# EAGLE design adc_40MHz (EAGLE 7.4.0)
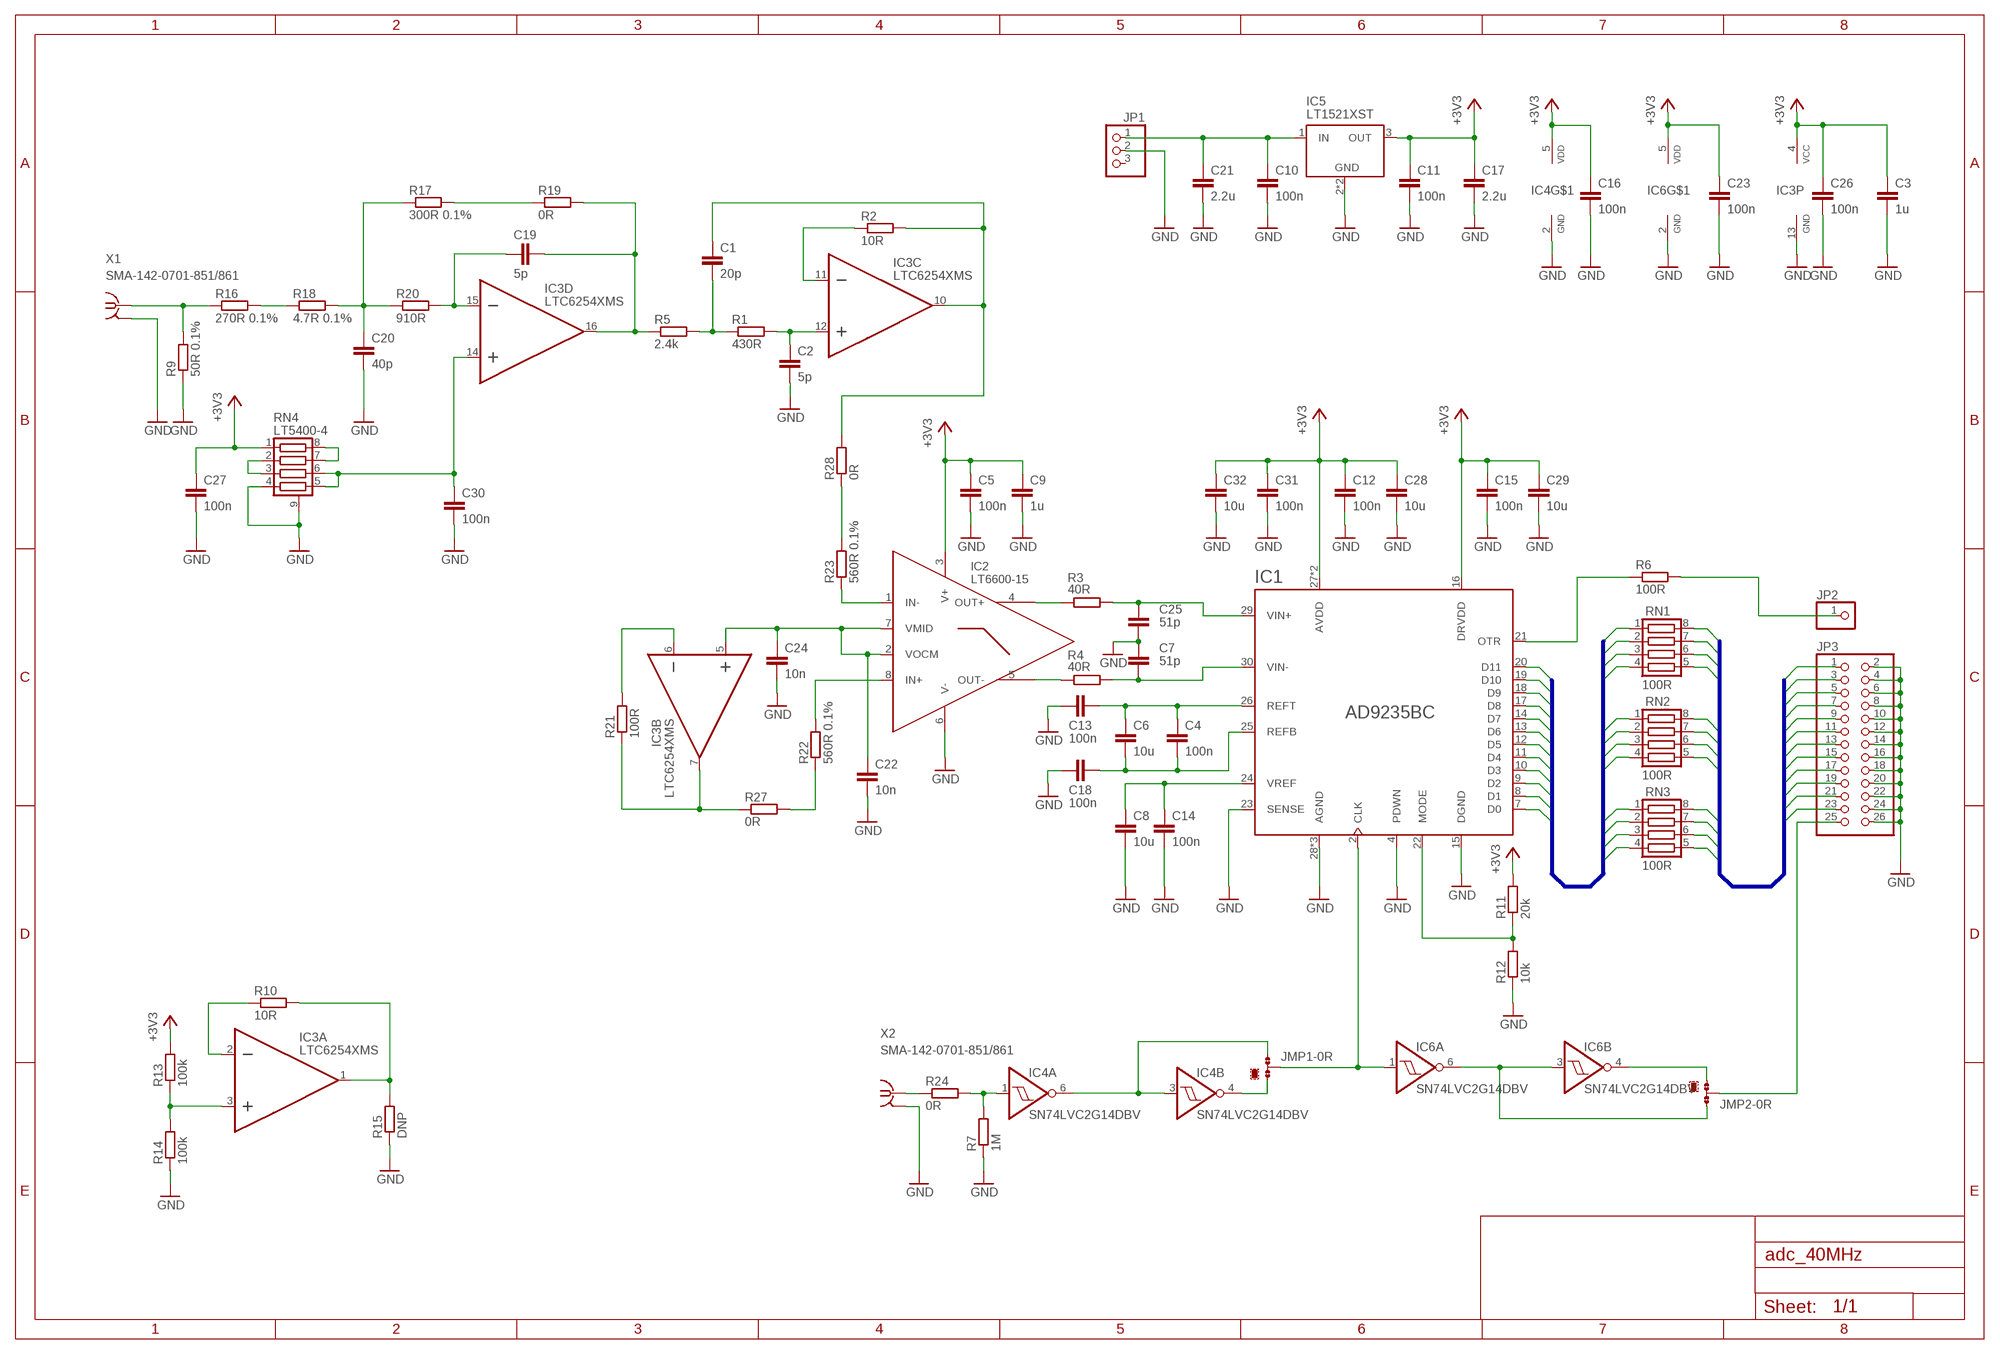
[diagram p0: schematic, sheet 1]

## Parts
C1  20p  C-EUC0603K  [C0603K]
C2  5p  C-EUC0603K  [C0603K]
C3  1u  C-EUC0805  [C0805]
C4  100n  C-EUC0603K  [C0603K]
C5  100n  C-EUC0603K  [C0603K]
C6  10u  C-EUC1206  [C1206]
C7  51p  C-EUC0603K  [C0603K]
C8  10u  C-EUC1206  [C1206]
C9  1u  C-EUC0805  [C0805]
C10  100n  C-EUC0603K  [C0603K]
C11  100n  C-EUC0603K  [C0603K]
C12  100n  C-EUC0603K  [C0603K]
C13  100n  C-EUC0603K  [C0603K]
C14  100n  C-EUC0603K  [C0603K]
C15  100n  C-EUC0603K  [C0603K]
C16  100n  C-EUC0603K  [C0603K]
C17  2.2u  C-EUC0805  [C0805]
C18  100n  C-EUC0603K  [C0603K]
C19  5p  C-EUC0603K  [C0603K]
C20  40p  C-EUC0603K  [C0603K]
C21  2.2u  C-EUC0805  [C0805]
C22  10n  C-EUC0603K  [C0603K]
C23  100n  C-EUC0603K  [C0603K]
C24  10n  C-EUC0603K  [C0603K]
C25  51p  C-EUC0603K  [C0603K]
C26  100n  C-EUC0603K  [C0603K]
C27  100n  C-EUC0603K  [C0603K]
C28  10u  C-EUC1206  [C1206]
C29  10u  C-EUC1206  [C1206]
C30  100n  C-EUC0603K  [C0603K]
C31  100n  C-EUC0603K  [C0603K]
C32  10u  C-EUC1206  [C1206]
IC1  AD9235BC  [LFCSP32]
IC2  LT6600-15  [S8]
IC3  LTC6254XMS  [MSOP16]
IC4  SN74LVC2G14DBV  [SOT23-6]
IC5  LT1521XST  [SOT223]
IC6  SN74LVC2G14DBV  [SOT23-6]
JMP1  0R-JUMPA  [A0R-JMP]
JMP2  0R-JUMPA  [A0R-JMP]
JP1  PINHD-1X3  [1X03]
JP2  PINHD-1X1  [1X01]
JP3  PINHD-2X13  [2X13]
R1  430R  R-EU_R0603  [R0603]
R2  10R  R-EU_R0603  [R0603]
R3  40R  R-EU_R0603  [R0603]
R4  40R  R-EU_R0603  [R0603]
R5  2.4k  R-EU_R0603  [R0603]
R6  100R  R-EU_R0603  [R0603]
R7  1M  R-EU_R0603  [R0603]
R9  50R 0.1%  R-EU_R0603  [R0603]
R10  10R  R-EU_R0603  [R0603]
R11  20k  R-EU_R0603  [R0603]
R12  10k  R-EU_R0603  [R0603]
R13  100k  R-EU_R0603  [R0603]
R14  100k  R-EU_R0603  [R0603]
R15  DNP  R-EU_R0603  [R0603]
R16  270R 0.1%  R-EU_R0603  [R0603]
R17  300R 0.1%  R-EU_R0603  [R0603]
R18  4.7R 0.1%  R-EU_R0603  [R0603]
R19  0R  R-EU_R0603  [R0603]
R20  910R  R-EU_R0603  [R0603]
R21  100R  R-EU_R0603  [R0603]
R22  560R 0.1%  R-EU_R0603  [R0603]
R23  560R 0.1%  R-EU_R0603  [R0603]
R24  0R  R-EU_R0603  [R0603]
R27  0R  R-EU_R0603  [R0603]
R28  0R  R-EU_R0603  [R0603]
RN1  100R  CTS742C083  [EXB38V]
RN2  100R  CTS742C083  [EXB38V]
RN3  100R  CTS742C083  [EXB38V]
RN4  LT5400-4  LT5400  [MS8E]
X1  SMA-142-0701-851/861  [J502-ND-142-0701-851/861]
X2  SMA-142-0701-851/861  [J502-ND-142-0701-851/861]

## Nets
+3V3: C3.1 C5.1 C9.1 C11.1 C12.1 C15.1 C16.1 C17.1 C23.1 C26.1 C27.1 C28.1 C29.1 C31.1 C32.1 IC1.16(DRVDD) IC1.27(AVDD) IC1.32(AVDD) IC2.3(V+) IC3.4(P:V+) IC4.5(V+) IC5.3(OUT) IC6.5(V+) R11.2 R13.2 RN4.1
ADC_D0: IC1.7(D0) RN3.4
ADC_D1: IC1.8(D1) RN3.3
ADC_D2: IC1.9(D2) RN3.2
ADC_D3: IC1.10(D3) RN3.1
ADC_D4: IC1.11(D4) RN2.4
ADC_D5: IC1.12(D5) RN2.3
ADC_D6: IC1.13(D6) RN2.2
ADC_D7: IC1.14(D7) RN2.1
ADC_D8: IC1.17(D8) RN1.4
ADC_D9: IC1.18(D9) RN1.3
ADC_D10: IC1.19(D10) RN1.2
ADC_D11: IC1.20(D11) RN1.1
CLK: JMP2.2 JP3.25
DAC_D0: JP3.23 RN3.5
DAC_D1: JP3.21 RN3.6
DAC_D2: JP3.19 RN3.7
DAC_D3: JP3.17 RN3.8
DAC_D4: JP3.15 RN2.5
DAC_D5: JP3.13 RN2.6
DAC_D6: JP3.11 RN2.7
DAC_D7: JP3.9 RN2.8
DAC_D8: JP3.7 RN1.5
DAC_D9: JP3.5 RN1.6
DAC_D10: JP3.3 RN1.7
DAC_D11: JP3.1 RN1.8
GND: C2.2 C3.2 C5.2 C7.1 C8.2 C9.2 C10.2 C11.2 C12.2 C13.1 C14.2 C15.2 C16.2 C17.2 C18.1 C20.2 C21.2 C22.2 C23.2 C24.2 C25.2 C26.2 C27.2 C28.2 C29.2 C30.2 C31.2 C32.2 IC1.4(PDWN) IC1.15(DGND) IC1.23(SENSE) IC1.28(AGND) IC1.31(AGND) IC1.EXP(AGND) IC2.6(V-) IC3.13(P:V-) IC4.2(V-) IC5.2(GND) IC5.4(GND) IC6.2(V-) JP1.2 JP3.2 JP3.4 JP3.6 JP3.8 JP3.10 JP3.12 JP3.14 JP3.16 JP3.18 JP3.20 JP3.22 JP3.24 JP3.26 R7.1 R9.1 R12.1 R14.1 R15.1 RN4.4 RN4.9(EP) X1.G@1 X1.G@2 X1.G@3 X1.G@4 X2.G@1 X2.G@2 X2.G@3 X2.G@4
N$1: IC2.4(OUT+) R3.1
N$2: C25.1 IC1.29(VIN+) R3.2
N$3: C7.2 IC1.30(VIN-) R4.2
N$4: IC2.5(OUT-) R4.1
N$5: C8.1 C14.1 IC1.24(VREF)
N$6: IC1.21(OTR) R6.1
N$7: C4.2 C6.2 C18.2 IC1.25(REFB)
N$8: JP2.1 R6.2
N$10: C22.1 C24.1 IC2.2(VOCM) IC2.7(VMID) IC3.5(B:+IN)
N$12: IC3.3(A:+IN) R13.1 R14.2
N$13: IC3.7(B:OUT) R21.1 R27.1
N$14: IC3.2(A:-IN) R10.1
N$15: IC3.1(A:OUT) R10.2 R15.2
N$16: RN4.7 RN4.8
N$17: IC3.6(B:-IN) R21.2
N$18: R24.1 X2.1
N$19: R16.2 R18.1
N$20: C20.1 R17.1 R18.2 R20.1
N$21: R17.2 R19.1
N$22: C19.2 IC3.16(D:OUT) R5.1 R19.2
N$23: C19.1 IC3.15(D:-IN) R20.2
N$24: C30.1 IC3.14(D:+IN) RN4.5 RN4.6
N$25: RN4.2 RN4.3
N$26: IC3.11(C:-IN) R2.1
N$27: C1.1 IC3.10(C:OUT) R2.2 R28.2
N$28: C1.2 R1.1 R5.2
N$29: C2.1 IC3.12(C:+IN) R1.2
N$30: IC2.8(IN+) R22.2
N$31: IC2.1(IN-) R23.1
N$32: IC1.22(MODE) R11.1 R12.2
N$33: C4.1 C6.1 C13.2 IC1.26(REFT)
N$34: IC4.1(A:I) R7.2 R24.2
N$36: IC4.3(B:I) IC4.6(A:O) JMP1.1
N$37: IC1.2(CLK) IC6.1(A:I) JMP1.2
N$38: IC6.3(B:I) IC6.6(A:O) JMP2.1
N$39: IC4.4(B:O) JMP1.3
N$40: R23.2 R28.1
N$41: IC6.4(B:O) JMP2.3
N$42: R22.1 R27.2
SIGIN: R9.2 R16.1 X1.1
VIN: C10.1 C21.1 IC5.1(IN) JP1.1
Unconnected: JP1.3

## Buses
ADC_D[0..11]
DAC_D[0..11]

## Library data of the parts
C1 C2 C4 C5 C7 C10-C16 C18-C20 C22-C27 C30 C31 = resistor:C-EU: CAPACITOR, European symbol
C3 C6 C8 C9 C17 C21 C28 C29 C32 = rcl:C-EU: CAPACITOR, European symbol
IC1 = ad9235:AD9235: 12 Bit A/D - Wandler (Analog)
IC2 = lt6600:LT6600-15: Very Low Noise, Differential Amplifier and 15MHz Lowpass Filter
IC3 = ltc625x:LTC6254X
IC4 IC6 = sn74lvc2g14:SN74LVC2G14
IC5 = lt1521:LT1521XST
JMP1 JMP2 = jump-0r-smd:0R-JUMP: SMD 0R 0805 Jumper
JP1 = moj_pinhead:PINHD-1X3: PIN HEADER
JP2 = pinhead:PINHD-1X1: PIN HEADER
JP3 = moj_pinhead:PINHD-2X13: PIN HEADER
R1-R7 R9-R24 R27 R28 = rcl:R-EU_: RESISTOR, European symbol
RN1-RN3 = passive:CTS742C083: Chip Resistor Array 4 Single Resistor Source: http://www.ctscorp.com/components/Datasheets/CTSChipArrayDs.pdf
RN4 = lt5400:LT5400
X1 X2 = con-coax:SMA-: SMA 50 Ohm End Launch Jack Receptacle - Round Contact Johnson Components Source: www.johnsoncomponents.com .. J502-ND.pdf; MF: JOHNSON COMPONENTS; MPN: 142-0701-851; OC_FARNELL: 1019325; OC_NEWARK: 99F6798

## Board
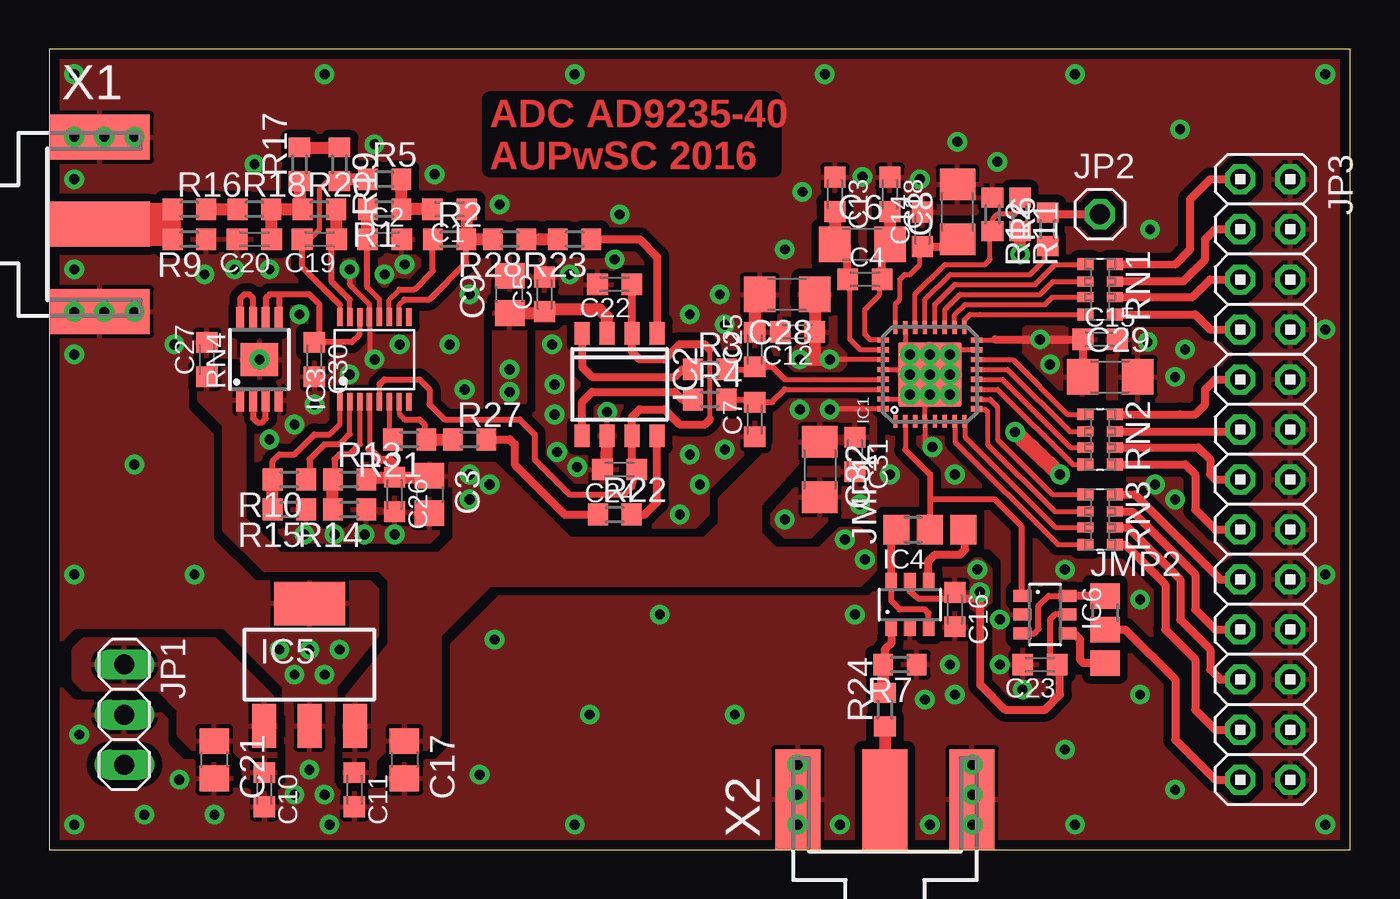
[diagram p1: board, top side]
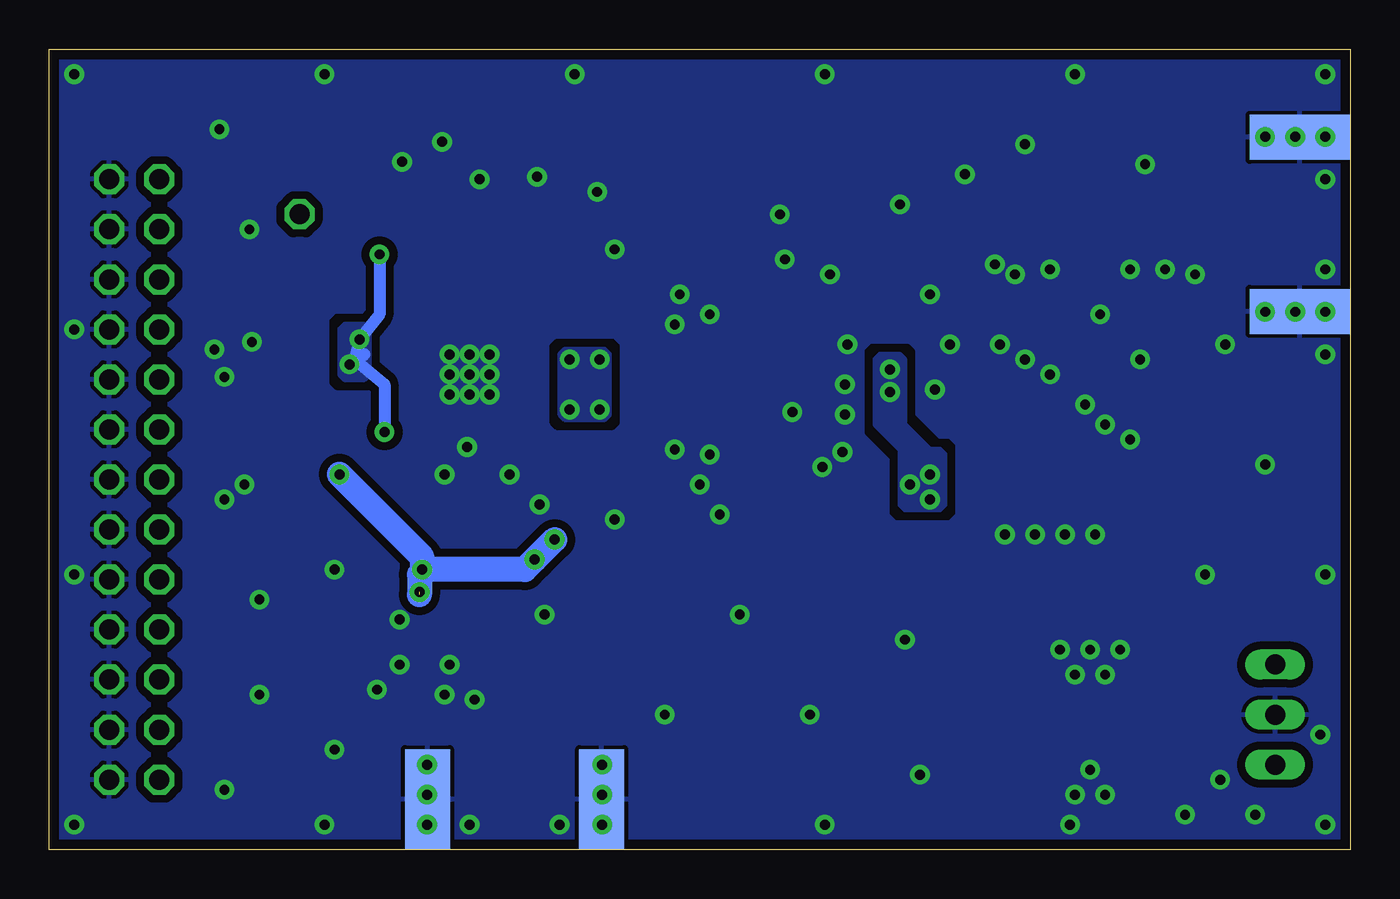
[diagram p2: board, bottom side, seen from below]

Size 66.04 x 40.64 mm. Coordinates in mm from the lower left corner, seen from the top.
Outline: 0,0 66.04,0 66.04,40.64 0,40.64 0,0
Copper layers (1*2+16): Top 0.035mm / dielectric 1.5mm / Route2 0.035mm / dielectric 0.15mm / Bottom 0.035mm
Design rules "satland_standard": minimum track width 8mil, minimum drill 0.3mm, track to track 8mil, track to pad 8mil, pad to pad 8mil, via to via 8mil, smd to smd 0mil, copper to edge 20mil, drill to drill 10mil, minimum pad ring 8mil, minimum via ring 8mil, stop-mask expansion 4mil, vias tented up to drill 0mil, thermal gap 8mil

### Footprints (pad centres in the part's own frame; a part is rotated, then mirrored left to right if it is on the bottom)
C0603K = smd 1.05 x 1.08: 1 -0.875,0; 2 0.875,0
C0805 = smd 1.3 x 1.5: 1 -0.95,0; 2 0.95,0
C1206 = smd 1.6 x 1.8: 1 -1.4,0; 2 1.4,0
LFCSP32 = smd 0.65 x 0.27: 1 -2.375,1.75; 2 -2.375,1.25; 3 -2.375,0.75; 4 -2.375,0.25; 5 -2.375,-0.25; 6 -2.375,-0.75; 7 -2.375,-1.25; 8 -2.375,-1.75; 17 2.375,-1.75; 18 2.375,-1.25; 19 2.375,-0.75; 20 2.375,-0.25; 21 2.375,0.25; 22 2.375,0.75; 23 2.375,1.25; 24 2.375,1.75 | smd 0.27 x 0.65: 9 -1.75,-2.375; 10 -1.25,-2.375; 11 -0.75,-2.375; 12 -0.25,-2.375; 13 0.25,-2.375; 14 0.75,-2.375; 15 1.25,-2.375; 16 1.75,-2.375; 25 1.75,2.375; 26 1.25,2.375; 27 0.75,2.375; 28 0.25,2.375; 29 -0.25,2.375; 30 -0.75,2.375; 31 -1.25,2.375; 32 -1.75,2.375 | smd 3.25 x 3.25: EXP 0,0
S8 = smd 0.762 x 1.143: 1 -1.905,-2.6; 2 -0.635,-2.6; 3 0.635,-2.6; 4 1.905,-2.6; 5 1.905,2.6; 6 0.635,2.6; 7 -0.635,2.6; 8 -1.905,2.6
MSOP16 = smd 0.275 x 0.9: 1 -1.75,-2.15; 2 -1.25,-2.15; 3 -0.75,-2.15; 4 -0.25,-2.15; 5 0.25,-2.15; 6 0.75,-2.15; 7 1.25,-2.15; 8 1.75,-2.15; 9 1.75,2.15; 10 1.25,2.15; 11 0.75,2.15; 12 0.25,2.15; 13 -0.25,2.15; 14 -0.75,2.15; 15 -1.25,2.15; 16 -1.75,2.15
SOT23-6 = smd 0.6 x 0.9: 1 -0.95,-1.15; 2 0,-1.15; 3 0.95,-1.15; 4 0.95,1.15; 5 0,1.15; 6 -0.95,1.15
SOT223 = smd 1.219 x 2.235: 1 -2.311,-3.099; 2 0,-3.099; 3 2.311,-3.099 | smd 3.6 x 2.2: 4 0,3.099
A0R-JMP = smd 1.5 x 1.3: 1 0,1.7; 2 0,0; 3 0,-1.7
1X03 = drill 1.016 long: 1 -2.54,0; 2 0,0; 3 2.54,0
1X01 = drill 1.016 octagon: 1 0,0
2X13 = drill 1.016 octagon: 1 -15.24,-1.27; 2 -15.24,1.27; 3 -12.7,-1.27; 4 -12.7,1.27; 5 -10.16,-1.27; 6 -10.16,1.27; 7 -7.62,-1.27; 8 -7.62,1.27; 9 -5.08,-1.27; 10 -5.08,1.27; 11 -2.54,-1.27; 12 -2.54,1.27; 13 0,-1.27; 14 0,1.27; 15 2.54,-1.27; 16 2.54,1.27; 17 5.08,-1.27; 18 5.08,1.27; 19 7.62,-1.27; 20 7.62,1.27; 21 10.16,-1.27; 22 10.16,1.27; 23 12.7,-1.27; 24 12.7,1.27; 25 15.24,-1.27; 26 15.24,1.27
R0603 = smd 1 x 1.1: 1 -0.85,0; 2 0.85,0
EXB38V = smd 0.6 x 0.8: 1 -1.275,-0.75; 4 1.275,-0.75; 5 1.275,0.75; 8 -1.275,0.75 | smd 0.5 x 0.8: 2 -0.4,-0.75; 3 0.4,-0.75; 6 0.4,0.75; 7 -0.4,0.75
MS8E = smd 0.4 x 1.2: 1 -0.975,-2.05; 2 -0.325,-2.05; 3 0.325,-2.05; 4 0.975,-2.05; 5 0.975,2.05; 6 0.325,2.05; 7 -0.325,2.05; 8 -0.975,2.05 | smd 1.88 x 1.68: 9 0,0
J502-ND-142-0701-851/861 = smd 5.08 x 2.286: 1 2.565,0; G@1 2.565,4.42; G@2 2.565,-4.42 | smd 5.08 x 2.286 bottom: G@3 2.565,4.42; G@4 2.565,-4.42

### Placement (x,y rotation side)
C1  20.32,32.51 180 top
C2  17.02,30.99 0 top
C3  19.3,18.03 270 top
C4  41.4,28.96 0 top
C5  25.15,28.19 90 top
C6  41.27,30.73 0 top
C7  35.81,21.84 90 top
C8  46.1,32.38 90 top
C9  23.37,28.19 90 top
C10  10.92,3.05 270 top
C11  15.49,3.05 270 top
C12  37.97,26.29 180 top
C13  39.88,33.27 270 top
C14  44.32,31.5 90 top
C15  53.34,25.91 0 top
C16  45.97,12.19 270 top
C17  18.03,4.57 270 top
C18  42.67,33.27 270 top
C19  13.72,30.99 180 top
C20  10.41,30.99 180 top
C21  8.38,4.57 270 top
C22  28.7,28.7 180 top
C23  50.29,9.4 180 top
C24  28.96,19.3 180 top
C25  35.81,25.4 90 top
C26  17.53,18.03 270 top
C27  8,24.89 90 top
C28  37.47,28.19 180 top
C29  53.85,24 0 top
C30  13.46,24.89 270 top
C31  40.89,20.07 270 top
C32  39.12,19.3 270 top
IC1  44.7,24.13 90 top
IC2  28.96,23.62 180 top
IC3  16.51,24.89 0 top
IC4  43.69,12.45 0 top
IC5  13.21,9.4 0 top
IC6  50.55,11.94 270 top
JMP1  44.7,16.26 90 top
JMP2  53.59,11.18 0 top
JP1  3.81,6.86 270 top
JP2  53.34,32.26 0 top
JP3  61.72,18.8 270 top
R1  17.02,32.51 180 top
R2  20.32,30.99 0 top
R3  33.53,24.38 0 top
R4  33.53,22.86 0 top
R5  17.02,34.04 0 top
R6  50.67,31.5 90 top
R7  43.18,9.4 180 top
R9  7.11,30.99 180 top
R10  12.19,18.8 180 top
R11  49.28,32.26 270 top
R12  47.88,32.26 270 top
R13  15.24,18.8 0 top
R14  15.24,17.27 180 top
R15  12.19,17.27 180 top
R16  7.11,32.51 0 top
R17  12.7,34.8 90 top
R18  10.41,32.51 0 top
R19  14.73,34.8 270 top
R20  13.72,32.51 0 top
R21  18.29,20.83 180 top
R22  28.7,17.02 0 top
R23  26.67,30.99 180 top
R24  42.42,7.11 90 top
R27  21.34,20.83 0 top
R28  23.37,30.99 180 top
RN1  53.34,28.45 270 top
RN2  53.34,20.83 270 top
RN3  53.34,16.76 270 top
RN4  10.67,24.89 0 top
X1  0,31.75 0 top
X2  42.42,0 90 top

### Tracks (layer width: path | path; a pad name or v marks a point on that pad's centre or on a via)
+3V3  (via drill 0.5 pad 1)  (1 unrouted)
  Top 0.254: IC3.4 16.26,20.32 | IC1.32 39.65,22.38 v39.62,22.35 | 39.64,24.88 v39.62,24.89 42.32,24.89 IC1.27 | IC1.16 47.98,25.88 48.01,25.91
  Top 0.305: IC4.5 43.69,13.11 44.08,12.76 46.18,12.76 C16.1 | C31.1 40.89,20.7 | IC6.5 51.05,11.94 50.8,11.68 50.8,9.77 C23.1
  Top 0.406: 16.26,20.32 16.76,19.81 17.27,19.81 17.53,19.56 C26.1 | R13.2 15.95,18.91 | 46.18,12.76 47.18,12.76 | v47.24,13.08 47.24,8.38 48.51,7.11 50.55,7.11 51.31,7.87 51.31,9.26 | C29.1 52.47,24.02 C15.1 v50.29,25.91 48.01,25.91
  Top 0.61: 15.95,18.91 C26.1 19.48,18.91 C3.1 | IC2.3 28.32,27.05 27.94,27.43 25.26,27.43 C5.1 25.32,27.24 C9.1 | 51.31,9.26 C23.1 | C28.1 38.87,26.31 C12.1 38.85,24.91 38.86,24.89 | v38.1,24.89 38.86,24.89 | 38.86,24.89 v39.62,24.89 | 40.66,20.7 C31.1 | R11.2 v49.28,30.23
  Top 0.813: 15.49,6.27 IC5.3 | v49.02,21.21 v51.31,19.05
  Bottom 0.61: v49.28,30.23 49.28,27.18 v50.29,25.91 50.55,24.89 | 50.55,24.89 49.02,23.62 v49.02,21.21 | v50.8,24.64 50.04,25.15 50.55,24.89
  Bottom 1.27: v40.39,15.75 v41.4,14.73 41.91,14.22 46.99,14.22 47.24,13.97 47.24,12.95 | v51.31,19.05 47.12,14.86 v47.12,14.22
  other vias: 23.37,23.24 23.37,24.38 21.34,19.05 22.35,18.54 21.34,17.78 38.1,22.35
  pour Top (isolate 0.61): 24.13,22.73 22.61,22.73 22.61,27.43 24.13,27.43
  pour Top (isolate 0.305): 19.81,10.92 22.35,13.46 41.15,13.46 41.91,14.22 41.91,15.49 41.15,16.26 40.13,16.26 39.12,15.24 36.83,15.24 36.07,16 36.07,17.53 38.35,20.07 40.13,20.07 40.13,20.32 41.91,20.32 41.91,21.84 40.89,22.86 37.59,22.86 36.83,22.1 36.83,20.57 34.04,17.78 34.04,16.51 33.27,15.75 26.42,15.75 22.61,19.56 15.75,19.56 15.75,18.54 20.57,18.54 20.57,15.75 19.81,14.99 11.68,14.99 9.91,16.76 9.91,23.37 9.14,23.37 9.14,24.38 7.62,24.38 7.62,22.86 8.89,21.59 8.89,16.26 10.92,14.22 16.76,14.22 17.27,13.72 17.27,10.41 14.99,7.62 14.99,3.56 16.26,3.56 16.51,3.81 16.51,4.57 17.02,5.08 19.05,5.08 19.81,5.84
  pour Bottom (isolate 0.406): 22.86,25.15 23.88,25.15 24.13,24.89 24.13,21.59 22.86,20.32 22.86,17.53 22.61,17.27 20.83,17.27 20.57,17.53 20.57,20.07 20.83,20.32 21.34,20.32 22.61,21.59 22.61,24.89
  pour Bottom (isolate 0.406): 37.59,25.15 37.85,25.4 39.88,25.4 40.13,25.15 40.13,22.1 39.88,21.84 37.85,21.84 37.59,22.1
  pour Top (isolate 0.406): 45.47,14.48 46.48,14.48 46.74,14.73 47.24,14.73 47.75,14.22 47.75,12.45 47.24,11.94 46.74,12.45 46.48,12.45 46.48,12.7 46.23,12.95 45.47,12.95
  pour Top: 37.85,24.38 40.13,24.38 40.39,24.64 40.39,25.15 39.88,25.65 39.88,27.18 39.62,27.43 39.62,28.96 38.1,28.96 38.1,25.65 37.59,25.15 37.59,24.64
  pour Bottom (isolate 0.406): 50.04,26.67 51.05,26.67 51.31,26.42 51.31,24.13 51.05,23.88 50.04,23.88 49.78,24.13 49.78,26.42
  pour Top (isolate 0.406): 49.78,26.67 51.31,26.67 51.56,26.42 51.82,26.42 53.09,26.42 53.09,23.11 51.82,23.11 51.56,23.11 50.8,23.88 50.55,23.88 49.78,24.64 49.53,24.89 49.53,26.42
ADC_D0
  Top 0.254: IC1.7 45.97,21.73 45.97,20.7 51.19,15.49 RN3.4
ADC_D1
  Top 0.254: IC1.8 46.48,21.73 46.48,20.95 51.07,16.36 RN3.3
ADC_D2
  Top 0.254: IC1.9 47.11,22.35 47.5,22.35 47.62,22.23 47.62,20.57 51.03,17.16 RN3.2
ADC_D3
  Top 0.254: IC1.10 47.1,22.86 47.75,22.86 48.13,22.48 48.13,20.83 50.92,18.04 RN3.1
ADC_D4
  Top 0.254: IC1.11 47.09,23.37 48.13,23.37 51.95,19.55 RN2.4
ADC_D5
  Top 0.254: IC1.12 48.39,23.88 51.84,20.43 RN2.3
ADC_D6
  Top 0.254: IC1.13 48.64,24.38 51.8,21.23 RN2.2
ADC_D7
  Top 0.254: IC1.14 48.91,24.88 51.68,22.1 RN2.1
ADC_D8
  Top 0.254: IC1.17 46.45,26.9 46.74,27.18 47.24,27.18 47.25,27.17 RN1.4
ADC_D9
  Top 0.254: IC1.18 45.95,27.16 46.48,27.69 50.55,27.69 50.91,28.05 RN1.3
ADC_D10
  Top 0.254: IC1.19 45.45,27.42 46.23,28.19 50.29,28.19 50.95,28.85 RN1.2
ADC_D11
  Top 0.254: IC1.20 44.95,27.68 45.97,28.7 50.04,28.7 51.05,29.72 RN1.1
CLK
  Top 0.406: JMP2.2 54.61,11.18 57.15,8.64 57.15,5.59 59.18,3.56 JP3.25
DAC_D0
  Top 0.406: RN3.5 54.62,15.49 56.64,13.46 56.64,11.18 58.17,9.65 58.17,7.11 59.18,6.1 JP3.23
DAC_D1
  Top 0.406: RN3.6 54.76,16.36 57.4,13.72 57.4,11.68 58.93,10.16 58.93,9.14 59.44,8.64 JP3.21
DAC_D2
  Top 0.406: RN3.7 54.97,17.16 58.17,13.97 58.17,12.19 59.18,11.18 JP3.19
DAC_D3
  Top 0.406: RN3.8 55.11,18.04 59.44,13.72 JP3.17
DAC_D4
  Top 0.406: RN2.5 57.66,19.56 58.17,19.05 58.17,17.27 59.18,16.26 JP3.15
DAC_D5
  Top 0.406: RN2.6 58.31,20.43 58.93,19.81 58.93,19.05 59.18,18.8 JP3.13
DAC_D6
  Top 0.406: RN2.7 60.34,21.23 JP3.11
DAC_D7
  Top 0.406: RN2.8 57.41,22.1 58.17,22.1 58.67,22.61 58.67,23.37 59.18,23.88 JP3.9
DAC_D8
  Top 0.406: RN1.5 58.17,27.17 58.93,26.42 JP3.7
DAC_D9
  Top 0.406: RN1.6 58.02,28.05 58.93,28.96 JP3.5
DAC_D10
  Top 0.406: JP3.3 59.18,31.5 58.67,30.99 58.67,29.97 57.55,28.85 RN1.7
DAC_D11
  Top 0.406: RN1.8 54.87,29.72 57.15,29.72 57.91,30.48 57.91,33.02 58.93,34.04 JP3.1
GND  (via drill 0.5 pad 1)
  Top 0.254: IC1.28 43.44,24.38 v43.69,24.13 | IC1.31 43.45,22.88 v43.69,23.11 | IC1.23 43.45,25.15 v43.69,25.15 | IC1.15 45.72,25.38 v45.72,25.15 | IC1.4 44.45,23.11 v44.7,23.11 | IC3.13 16.26,27.68 15.24,28.7 v15.24,29.46 | 16.26,26.92 16.26,25.15 v16.51,24.89 | 44.45,21.84 44.45,20.57
  Top 0.305: 2.56,28.17 X1.G@4
  Top 0.61: C24.2 28.32,19.8 IC2.6 | 35.81,26.42 35.81,27.69 36.07,27.94
  other vias: 17.02,29.21 10.67,24.89 17.78,25.65 15.24,24.13 44.7,24.13 45.72,24.13 44.7,25.15 45.72,23.11 18.03,29.72 13.46,22.61 11.18,20.83 12.95,16 14.48,16 16,16 17.53,16 26.42,29.21 21.34,28.19 21.08,23.37 20.32,25.65 25.65,22.1 25.53,25.65 25.78,20.19 26.8,19.43 12.45,21.59 11.68,10.16 14.73,10.16 13.21,10.16 12.45,8.89 13.97,8.89 13.21,4.06 12.45,2.79 13.97,2.79 55.75,25.78 57.66,25.4 57.15,24 48.26,11.68 48.26,9.4 49.4,8.13 45.72,9.4 44.45,7.62 45.97,7.87 41.15,17.53 42.67,19.05 45.97,19.05 1.27,39.37 13.97,39.37 26.67,39.37 39.37,39.37 52.07,39.37 64.77,39.37 1.27,1.27 14.22,1.27 26.67,1.27 40.13,1.27 44.7,1.27 52.07,1.27 64.77,1.27 1.52,5.84 1.27,25.15 64.77,26.42 64.77,13.97 1.27,29.46 1.27,34.04 10.41,34.8 19.56,34.29 16.51,35.81 22.86,32.77 28.96,32.26 32.51,27.18 34.29,26.67 34.04,28.19 37.34,30.48 41.27,34.16 38.23,33.4 44.2,34.04 46.1,35.94 48.13,34.92 55.88,31.5 55.37,7.87 57.15,3.05 55.37,12.7 51.56,14.22 56.13,18.54 57.15,17.78 1.27,13.97 6.6,3.56 8.38,1.78 4.83,1.78 4.32,19.56 7.37,13.97 7.87,29.21 11.18,29.46 9.4,29.46 6.35,25.65 57.4,36.58 51.56,5.08 32.51,20.07 34.29,20.32 32,17.02 28.32,22.23 25.65,23.62 12.7,27.18 37.34,16.76 33.02,18.54 28.7,29.97 22.61,10.67 30.99,11.94 40.89,11.94 34.8,6.86 27.43,6.86 44.83,20.45 37.97,4.32 37.97,2.79 37.97,1.27 46.86,4.32 46.86,1.27 46.86,2.79 1.27,36.2 4.32,36.2 2.79,36.2 1.27,27.3 4.32,27.3 2.79,27.3 21.84,3.81
  pour Bottom (isolate 0.406, rank 3): 0.25,40.39 0.25,0.25 65.79,0.25 65.79,40.39
  pour Top (isolate 0.406, rank 3): 0.25,40.39 0.25,0.25 65.79,0.25 65.79,40.39
N$1
  Top 0.406: IC2.4 27.05,24.51 27.56,24 31.75,24 32.13,24.38 R3.1
N$2
  Top 0.254: 37.34,23.88 IC1.29
  Top 0.305: R3.2 36.18,24.38 | C25.1 36.69,24.52 37.34,23.88
  Top 0.406: 36.18,24.38 C25.1
N$3
  Top 0.254: 37.34,23.37 42.32,23.37 IC1.30
  Top 0.305: R4.2 35.67,22.86 C7.2 36.69,22.72 37.34,23.37
N$4
  Top 0.406: IC2.5 27.05,22.73 27.56,23.24 31.75,23.24 32.13,22.86 R4.1
N$5
  Top 0.254: IC1.24 42.95,27.71 43.18,27.94 43.18,28.96 43.43,29.21 43.69,29.21 44.2,29.72 44.2,30.24 C14.1
  Top 0.406: C14.1 45.74,30.62 C8.1
N$6
  Top 0.254: IC1.21 44.45,27.94 45.72,29.21 49.78,29.21 50.55,29.97 50.55,30.52 R6.1
N$7
  Top 0.254: IC1.25 41.68,25.88 41.4,26.16 41.4,27.43 42.16,28.19 42.16,29.1 C4.2 | 42.28,30.72 C6.2 | C18.2 42.67,32.27
  Top 0.406: C4.2 42.28,30.72
  Top 0.61: 42.67,32.27 C6.2
N$8
  Top 0.406: R6.2 50.76,32.26 JP2.1
N$10
  Top 0.254: IC3.5 16.76,23.63 | 29.72,19.16 C24.1 | 33.53,21.84 33.53,25.4
  Top 0.305: 16.76,23.63 17.02,23.88 18.8,23.88 19.3,23.37 19.3,22.61 20.07,21.84 23.88,21.84 24.64,21.08 24.64,19.81 26.42,18.03 29.21,18.03 29.58,18.4 C24.1
  Top 0.406: C24.1 29.58,19.48 IC2.7 29.59,21.97 29.97,22.35 31.24,22.35 32,21.59 33.27,21.59 33.53,21.84 | 33.53,25.4 33.27,25.65 32,25.65 31.24,24.89 29.97,24.89 29.59,25.27 IC2.2 29.58,26.24 C22.1
N$12
  Top 0.254: IC3.3 15.76,20.59
  Top 0.305: 15.76,20.59 15.24,20.07 14.73,20.07 14.48,19.81 14.48,19.14 R13.1
  Top 0.61: R14.2 R13.1
N$13
  Top 0.254: IC3.7 17.76,22.12 18.03,21.84
  Top 0.305: 18.03,21.84 18.8,21.84 19.05,21.59 19.05,20.92 R21.1
  Top 0.61: R21.1 R27.1
N$14
  Top 0.254: 15.26,21.1 IC3.2
  Top 0.305: 13.04,18.88 R10.1 13.21,19.22 13.21,19.81 13.97,20.57 14.73,20.57 15.26,21.1
N$15
  Top 0.254: 14.22,21.08 14.76,21.62 IC3.1
  Top 0.305: R10.2 11.34,19.72 11.68,20.07 12.45,20.07 13.46,21.08 14.22,21.08
  Top 0.61: R15.2 R10.2
N$16
  Top 0.305: RN4.7 10.34,28.01 10.16,28.19 9.91,28.19 9.69,27.98 RN4.8
N$17
  Top 0.254: IC3.6 17.26,20.83 R21.2
N$18
  Top 0.61: R24.1 X2.1
N$19
  Top 0.61: R16.2 R18.1
N$20
  Top 0.61: R18.2 11.29,32.54 C20.1 11.29,32.51 R20.1 12.7,32.51 R17.1
  Top 0.813: R18.2 11.29,32.51
N$21
  Top 0.61: R17.2 R19.1
N$22
  Top 0.254: IC3.16 14.76,27.66 | C19.2 13.21,30.99 13.72,31.5 13.72,33.53 14.14,33.95 R19.2
  Top 0.305: 14.76,27.66 12.84,29.58 C19.2
  Top 0.61: R19.2 14.82,34.04 R5.1
N$23
  Top 0.254: IC3.15 15.26,27.92 | 14.34,30.99 C19.1
  Top 0.305: 15.26,27.92 14.34,28.84 14.34,30.99
  Top 0.61: R20.2 14.57,31.01 C19.1
N$24
  Top 0.254: RN4.5 11.68,26.98 | IC3.14 15.75,27.03 15.75,26.16
  Top 0.305: 11.68,26.98 11.68,28.19 | 11.68,28.19 11.18,28.19 10.99,28.01 RN4.6 | 11.68,28.19 13.21,28.19 13.72,27.69 13.72,25.91 13.57,25.77 C30.1 15.35,25.77 15.75,26.16
N$25
  Top 0.305: RN4.2 10.34,21.91 10.57,21.69 10.79,21.69 10.99,21.89 RN4.3
N$26
  Top 0.254: IC3.11 17.26,27.93 17.78,28.45
  Top 0.305: 17.78,28.45 18.54,28.45 19.47,29.38 R2.1
N$27
  Top 0.254: IC3.10 17.76,27.67 18.03,27.94
  Top 0.305: 18.03,27.94 19.3,27.94 21.17,29.81 R2.2
  Top 0.61: C1.1 21.2,31.01 R2.2 R28.2
N$28
  Top 0.61: R5.2 R1.1 C1.2
N$29
  Top 0.254: IC3.12 16.76,27.94 16.14,28.55
  Top 0.305: 16.14,28.55 16.14,30.88 16.26,30.99 C2.1
  Top 0.61: C2.1 16.14,32.49 R1.2
N$30
  Top 0.406: R22.2 30.23,17.02 30.86,17.65 IC2.8
N$31
  Top 0.406: R23.1 29.97,30.99 30.86,30.1 IC2.1
N$32
  Top 0.254: IC1.22 43.95,28.21 45.47,29.72 47.5,29.72 47.75,29.97 47.75,31.28 R12.2 47.88,32 48.13,32.26 49.02,32.26 49.28,32.51 R11.1
N$33
  Top 0.254: IC1.26 41.17,25.38 40.64,25.91 40.64,28.82 C4.1 | C13.2 39.88,32.27
  Top 0.406: C4.1 40.51,30.62 C6.1
  Top 0.61: 39.88,32.27 C6.1
N$34
  Top 0.406: IC4.1 42.74,10.48 42.42,10.16 42.42,9.49 R7.2
  Top 0.61: R7.2 42.33,8.05 R24.2
N$36
  Top 0.305: IC4.3 44.64,12 44.45,12.19 43.18,12.19 42.74,12.63 IC4.6
  Top 0.406: IC4.6 42.74,16 JMP1.1
N$37
  Top 0.254: IC1.2 43.45,20.3
  Top 0.305: 43.45,20.3 44.7,19.05 44.7,17.78 | 44.7,17.78 JMP1.2 | 44.7,17.78 48.01,17.78 49.34,16.44 49.34,12.94 IC6.1
N$38
  Top 0.305: IC6.3 50,10.99 50.22,11.2 50.22,12.37 50.73,12.89 IC6.6
  Top 0.406: JMP2.1 IC6.6
N$39
  Top 0.406: IC4.4 44.64,14.67 44.96,14.99 46.23,14.99 46.48,15.24 46.48,15.92 JMP1.3
N$40
  Top 0.61: R28.1 R23.2
N$41
  Top 0.406: 51.76,10.92 IC6.4 52,10.99 52.32,10.67 52.32,9.65 52.5,9.48 JMP2.3
N$42
  Top 0.406: R27.2 23.37,20.83 23.62,20.57 23.62,19.56 26.16,17.02 R22.1
SIGIN
  Top 0.254: R9.2 R16.1
  Top 0.305: R9.2 5.84,31.66 5.59,31.75
  Top 2.184: X1.1 5.59,31.75
VIN
  Top 0.813: 10.92,6.27 IC5.1
  pour Top (isolate 0.305): 1.27,10.16 1.78,10.67 8.38,10.67 11.43,7.62 11.43,3.56 10.16,3.56 9.91,3.81 9.91,4.57 9.4,5.08 7.37,5.08 6.6,5.84 6.6,7.11 5.59,8.13 1.78,8.13 1.27,8.64

### Text on the board
Top: ADC AD9235-40 / AUPwSC 2016